# Altium schematic sheet ESP32_CAN_V2-out.SchDoc: ESP32_CAN_V2 - OUT module
size A4; DrawnBy: Balazs Finaczy, Laszlo Goczan; SheetNumber: 4; SheetTotal: 6
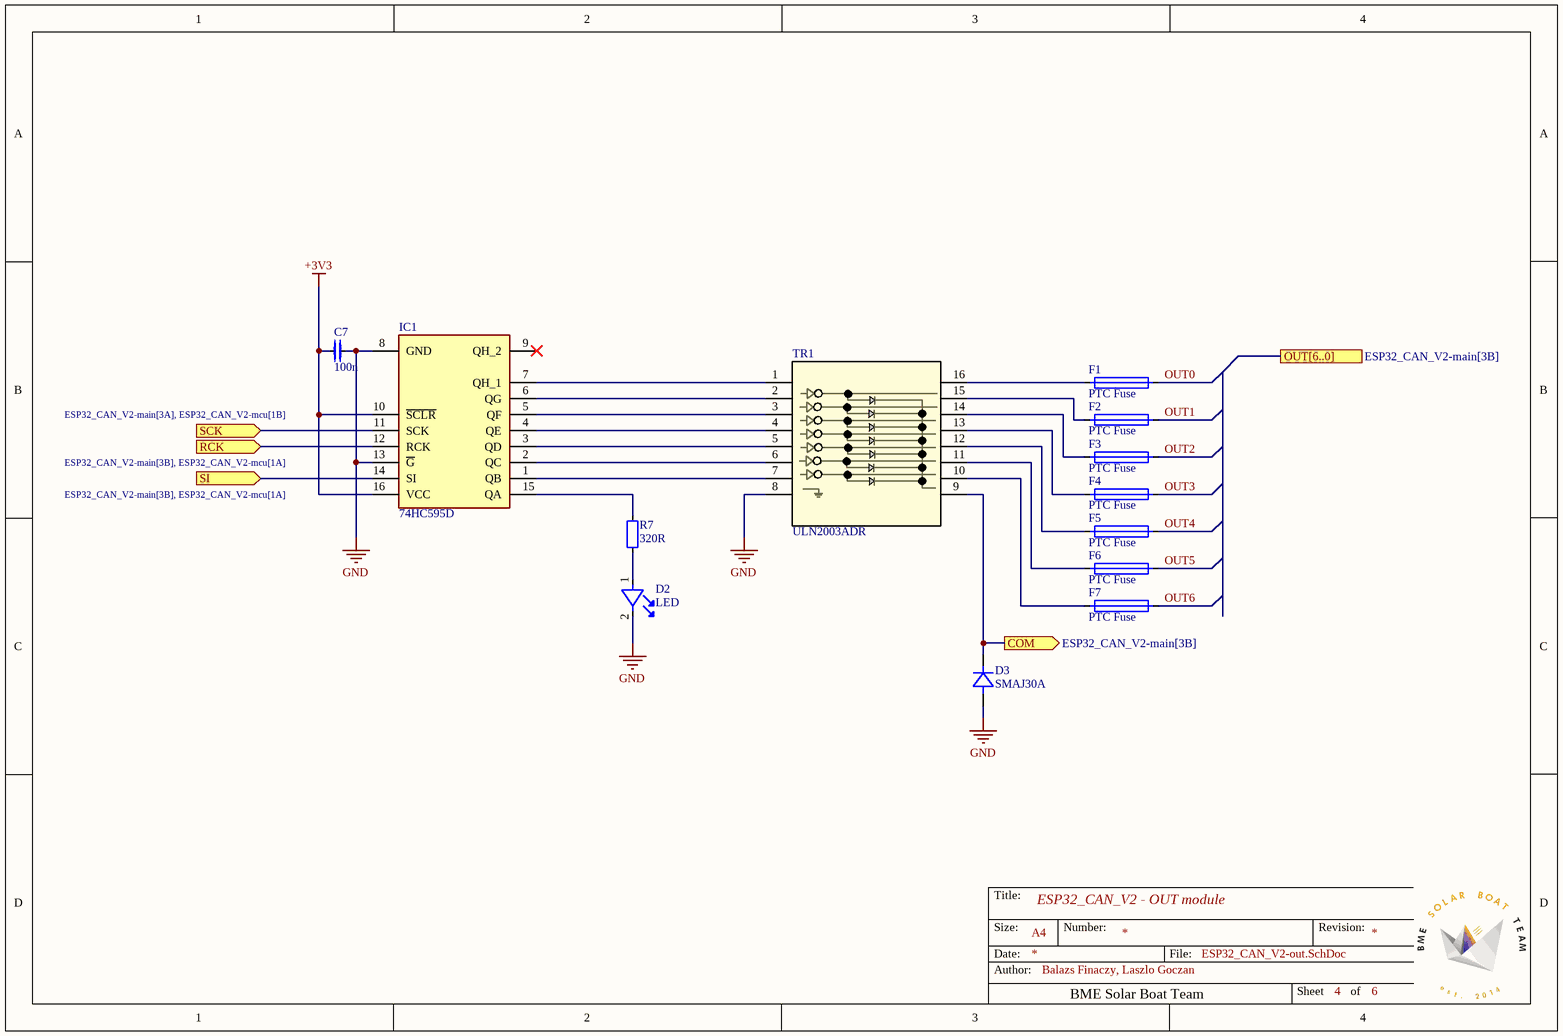
[diagram p0: ESP32_CAN_V2-out.SchDoc]

## Parts
C7  100n  [C0603]
D2  LED  [LED]
D3  SMAJ30A  [SMASeries_LTF]
F1  PTC Fuse  [PTSAHT120624V050]
F2  PTC Fuse  [PTSAHT120624V050]
F3  PTC Fuse  [PTSAHT120624V050]
F4  PTC Fuse  [PTSAHT120624V050]
F5  PTC Fuse  [PTSAHT120624V050]
F6  PTC Fuse  [PTSAHT120624V050]
F7  PTC Fuse  [PTSAHT120624V050]
IC1  74HC595D  [SOIC127P600X175-16N]
R7  320R  [R0603]
TR1  ULN2003ADR  [ULN2003ADR2G_OSI]

## Ports
COM (out, see ESP32_CAN_V2-main[3B]), OUT[6..0] (see ESP32_CAN_V2-main[3B]), RCK (in, see ESP32_CAN_V2-main[3B], ESP32_CAN_V2-mcu[1A]), SCK (in, see ESP32_CAN_V2-main[3A], ESP32_CAN_V2-mcu[1B]), SI (in, see ESP32_CAN_V2-main[3B], ESP32_CAN_V2-mcu[1A])

## Nets
+3V3: C7.1 IC1.10(~{SCLR}) IC1.16(VCC)
GND: C7.2 D2.2 D3.2 IC1.8(GND) IC1.13(~{G}) TR1.8
COM: D3.1 TR1.9 ; port COM
OUT0: F1.2
OUT1: F2.2
OUT2: F3.2
OUT3: F4.2
OUT4: F5.2
OUT5: F6.2
OUT6: F7.2
RCK: IC1.12(RCK) ; port RCK
SCK: IC1.11(SCK) ; port SCK
SI: IC1.14(SI) ; port SI
NetD2_1: D2.1 R7.2
NetF1_1: F1.1 TR1.16
NetF2_1: F2.1 TR1.15
NetF3_1: F3.1 TR1.14
NetF4_1: F4.1 TR1.13
NetF5_1: F5.1 TR1.12
NetF6_1: F6.1 TR1.11
NetF7_1: F7.1 TR1.10
NetIC1_1: IC1.1(QB) TR1.7
NetIC1_2: IC1.2(QC) TR1.6
NetIC1_3: IC1.3(QD) TR1.5
NetIC1_4: IC1.4(QE) TR1.4
NetIC1_5: IC1.5(QF) TR1.3
NetIC1_6: IC1.6(QG) TR1.2
NetIC1_7: IC1.7(QH_1) TR1.1
NetIC1_15: IC1.15(QA) R7.1

Not connected (* = marked no-connect by the designer): IC1 9(QH_2)*

## Notes on the sheet
- Title:
- Size:
- Date:
- Author:
- A4
- Number:
- BME Solar Boat Team
- File:
- Revision:
- Sheet
- of

## Library data of the parts
C7 = C
D2 = LED: 150060BS83000
D3 = SMAJ30A: No Description Available; Manufacturer_Name: Littelfuse Inc; Copyright: Copyright (C) 2026 Ultra Librarian. All rights reserved.; Manufacturer_Part_Number: SMAJ30A
F1-F7 = PTC Fuse: PTSAHT1206
IC1 = 74HC595D: Shift Register Single 8-Bit Serial to Serial/Parallel 16-Pin SOIC T/R; Manufacturer_Name: Toshiba; Geometry.Height: 1.75mm; Mouser Part Number: 757-74HC595D; Mouser Price/Stock: https://www.mouser.co.uk/ProductDetail/Toshiba/74HC595D?qs=7EBvPakHacViJoQmXKcnew%3D%3D; Manufacturer_Part_Number: 74HC595D; Datasheet Link: https://toshiba.semicon-storage.com/info/docget.jsp?did=36768&prodName=74HC595D
R7 = R
TR1 = ULN2003ADR2G: No Description Available; Manufacturer_Name: onsemi; Copyright: Copyright (C) 2026 Ultra Librarian. All rights reserved.; Manufacturer_Part_Number: ULN2003ADR2G; RefDes: RefDes; Type: Type